# Altium schematic sheet ADC.SchDoc
size A; DocumentNumber: 2; SheetNumber: 2; SheetTotal: 2
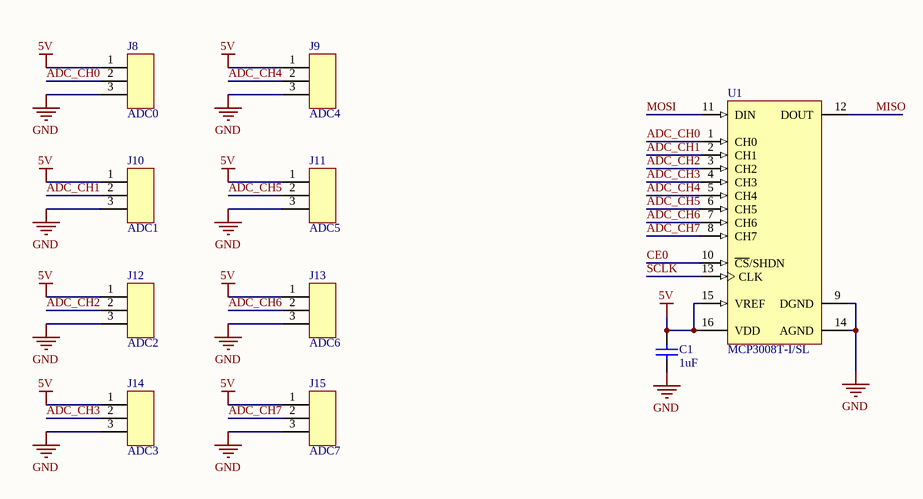
[diagram p0: ADC.SchDoc]

## Parts
C1  1uF  [C0805]
J8  ADC0  [PCB-s0hfil65plaomi4ibvcw-1]
J9  ADC4  [PCB-s0hfil65plaomi4ibvcw-1]
J10  ADC1  [PCB-s0hfil65plaomi4ibvcw-1]
J11  ADC5  [PCB-s0hfil65plaomi4ibvcw-1]
J12  ADC2  [PCB-s0hfil65plaomi4ibvcw-1]
J13  ADC6  [PCB-s0hfil65plaomi4ibvcw-1]
J14  ADC3  [PCB-s0hfil65plaomi4ibvcw-1]
J15  ADC7  [PCB-s0hfil65plaomi4ibvcw-1]
U1  MCP3008T-I/SL  [SOIC-SL16_L]

## Nets
5V: C1.1 J8.1 J9.1 J10.1 J11.1 J12.1 J13.1 J14.1 J15.1 U1.15(VREF) U1.16(VDD)
GND: C1.2 J8.3 J9.3 J10.3 J11.3 J12.3 J13.3 J14.3 J15.3 U1.9(DGND) U1.14(AGND)
ADC_CH0: J8.2 U1.1(CH0)
ADC_CH1: J10.2 U1.2(CH1)
ADC_CH2: J12.2 U1.3(CH2)
ADC_CH3: J14.2 U1.4(CH3)
ADC_CH4: J9.2 U1.5(CH4)
ADC_CH5: J11.2 U1.6(CH5)
ADC_CH6: J13.2 U1.7(CH6)
ADC_CH7: J15.2 U1.8(CH7)
CE0: U1.10(~{CS}/SHDN)
MISO: U1.12(DOUT)
MOSI: U1.11(DIN)
SCLK: U1.13(CLK)

## Library data of the parts
C1 = CMP-77c3bc4dc880a804-3: 0805 1 uF 25 V ±10 % Tolerance X7R SMT Multilayer Ceramic Capacitor; Manufacturer Part Number: CC0805KKX7R8BB105; Lead-Free Status: Lead Free; Voltage Rating (DC): 25.0 V; Capacitance Tolerance: ±10%; Octopart Url: http://octopart.com/cc0805kkx7r8bb105-yageo-42244645; Seller Landing  Url: https://octopart-clicks.com/click/track?country=US&ak=8157f166&sig=04b9cde&sid=5489&ppid=42244645&vpid=127579773&ct=offers; Number of Pins: 2; Mounting Style: Surface Mount; Packaging: Cut Tape (CT); Case/Package: 0805; REACH SVHC Compliance: No SVHC; RoHS: Compliant; Halogen Free Status: Halogen Free; Capacitance: 1uF; OctopartID: 77c3bc4dc880a804; Dielectric Characteristic: X7R
J8-J15 = CMP-8a90426ffa175557-32: THT Vertical Pin Header WR-PHD, Pitch 2.54 mm, Single Row, 3 pins; Manufacturer Part Number: 61300311121; Dielectric Withstanding Voltage: 500 V; Current Rating: 3.00 A; Number of Contacts: 3; Gender: Male; Contact Material: Copper; OctopartID: 8a90426ffa175557; Mounting Style: Through Hole; Operating Temperature: -40.0 °C (min); RoHS: Compliant; Packaging: Bag; REACH SVHC Compliance: No SVHC; Number of Pins: 3
U1 = CMP-1038587-6: 2.7V 4-Channel/8-Channel 10-Bit A/D Converters with SPI Serial Interface, 16-Pin SOIC 150mil, Industrial Temperature, Tape and Reel; Output Voltage: 4.1 V; Digital Logic Level: SAR; Number of Channels: 8; Number of Bits: 10; Supply Current: 0.000425 A; Lead-Free Status: Lead Free; Sample Rate: 200000.0 Hz; Number of Pins: 16; OctopartID: 6ffda6f17db7b03a; Mounting Style: Surface Mount; Case/Package: SOIC; Manufacturer Part Number: MCP3008T-I/SL; Lifecycle Status: Active; Octopart Url: https://octopart.com/mcp3008t-i%2Fsl-microchip-407340; RoHS: Compliant